# EAGLE design SNAC  7ch SNES in Housing - Minimal with JST (EAGLE 9.0.1)
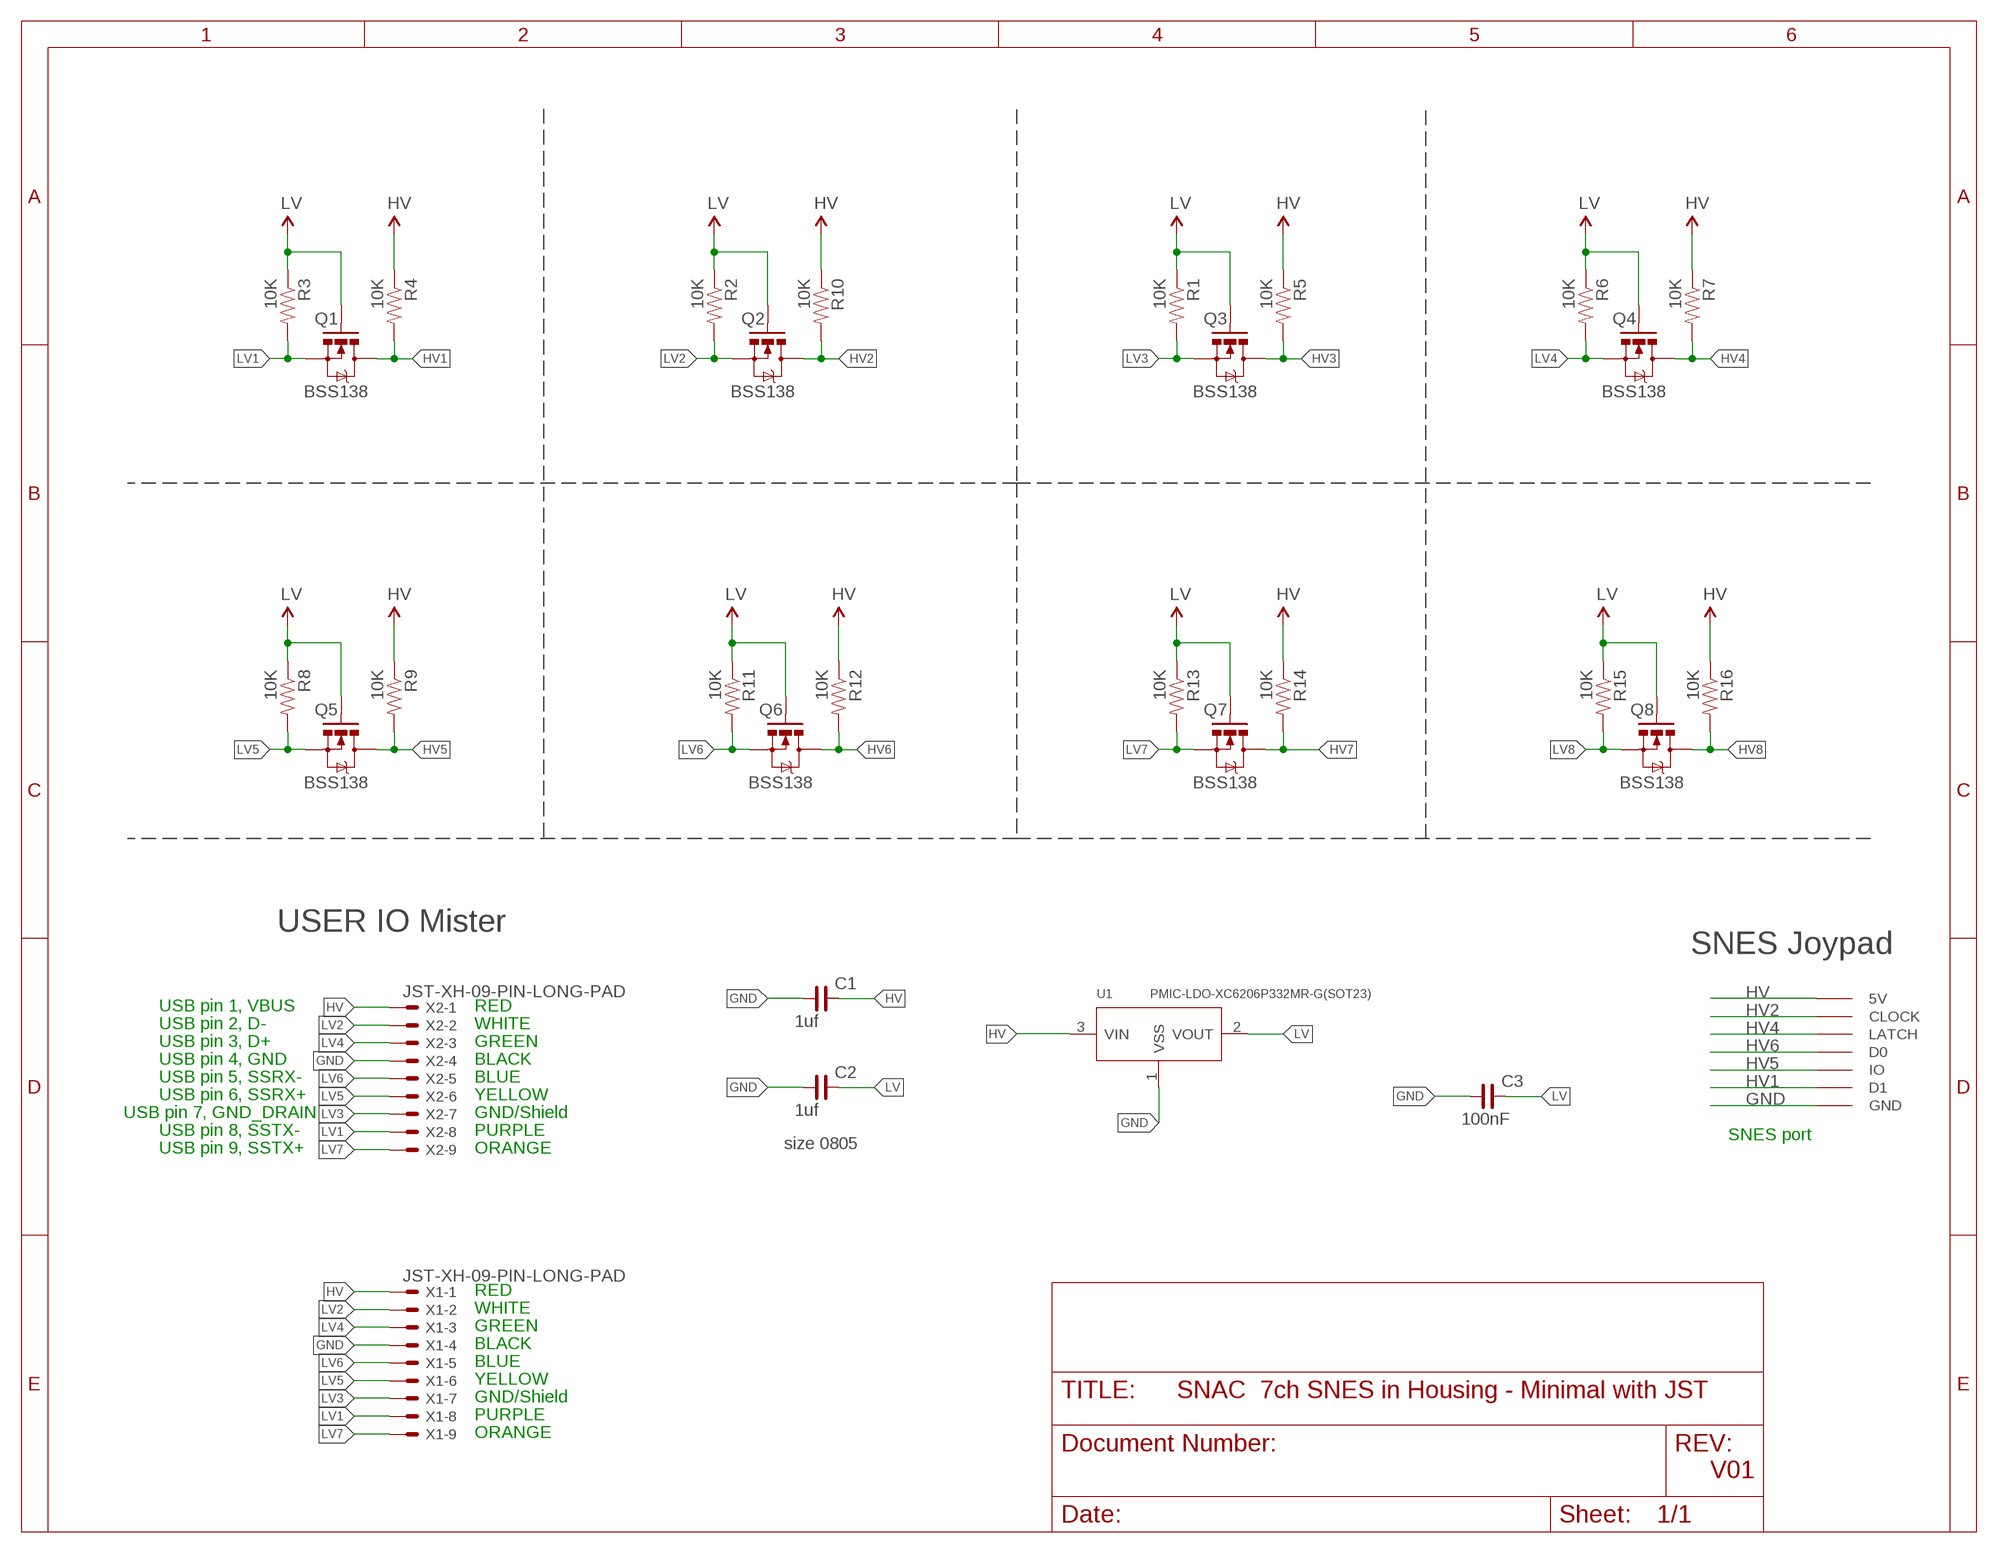
[diagram p0: schematic, sheet 1]

## Parts
C1  1uf  C_0805  [C0805]
C2  1uf  C_0805  [C0805]
C3  100nF  C_0805  [C0805]
Q1  BSS138  MOSFET-NCHANNELSMD  [SOT23-3]
Q2  BSS138  MOSFET-NCHANNELSMD  [SOT23-3]
Q3  BSS138  MOSFET-NCHANNELSMD  [SOT23-3]
Q4  BSS138  MOSFET-NCHANNELSMD  [SOT23-3]
Q5  BSS138  MOSFET-NCHANNELSMD  [SOT23-3]
Q6  BSS138  MOSFET-NCHANNELSMD  [SOT23-3]
Q7  BSS138  MOSFET-NCHANNELSMD  [SOT23-3]
Q8  BSS138  MOSFET-NCHANNELSMD  [SOT23-3]
R1  10K  RESISTOR0603-RES  [0603-RES]
R2  10K  RESISTOR0603-RES  [0603-RES]
R3  10K  RESISTOR0603-RES  [0603-RES]
R4  10K  RESISTOR0603-RES  [0603-RES]
R5  10K  RESISTOR0603-RES  [0603-RES]
R6  10K  RESISTOR0603-RES  [0603-RES]
R7  10K  RESISTOR0603-RES  [0603-RES]
R8  10K  RESISTOR0603-RES  [0603-RES]
R9  10K  RESISTOR0603-RES  [0603-RES]
R10  10K  RESISTOR0603-RES  [0603-RES]
R11  10K  RESISTOR0603-RES  [0603-RES]
R12  10K  RESISTOR0603-RES  [0603-RES]
R13  10K  RESISTOR0603-RES  [0603-RES]
R14  10K  RESISTOR0603-RES  [0603-RES]
R15  10K  RESISTOR0603-RES  [0603-RES]
R16  10K  RESISTOR0603-RES  [0603-RES]
SNES_CON  SNESCONN  [SNESCONN]
U1  PMIC-LDO-XC6206P332MR-G(SOT23)  [SOT-23]
X1  JST-XH-09-PIN-LONG-PAD  [JST-XH-09-PACKAGE-LONG-PAD]
X2  JST-XH-09-PIN-LONG-PAD  [JST-XH-09-PACKAGE-LONG-PAD]

## Nets
GND: C1.1 C2.1 C3.1 SNES_CON.GND U1.1(VSS) X1.4 X2.4
HV: C1.2 R4.1 R5.1 R7.1 R9.1 R10.1 R12.1 R14.1 R16.1 SNES_CON.5V U1.3(VIN) X1.1 X2.1
HV1: Q1.3(D) R4.2 SNES_CON.D1
HV2: Q2.3(D) R10.2 SNES_CON.CLOCK
HV3: Q3.3(D) R5.2
HV4: Q4.3(D) R7.2 SNES_CON.LATCH
HV5: Q5.3(D) R9.2 SNES_CON.IO
HV6: Q6.3(D) R12.2 SNES_CON.D0
HV7: Q7.3(D) R14.2
HV8: Q8.3(D) R16.2
LV: C2.2 C3.2 Q1.1(G) Q2.1(G) Q3.1(G) Q4.1(G) Q5.1(G) Q6.1(G) Q7.1(G) Q8.1(G) R1.1 R2.1 R3.1 R6.1 R8.1 R11.1 R13.1 R15.1 U1.2(VOUT)
LV1: Q1.2(S) R3.2 X1.8 X2.8
LV2: Q2.2(S) R2.2 X1.2 X2.2
LV3: Q3.2(S) R1.2 X1.7 X2.7
LV4: Q4.2(S) R6.2 X1.3 X2.3
LV5: Q5.2(S) R8.2 X1.6 X2.6
LV6: Q6.2(S) R11.2 X1.5 X2.5
LV7: Q7.2(S) R13.2 X1.9 X2.9
LV8: Q8.2(S) R15.2

## Notes on the sheet
- USER IO Mister
- SNES Joypad
- USB pin 1, VBUS | RED
- USB pin 2, D- | WHITE
- USB pin 3, D+ | GREEN
- USB pin 4, GND | BLACK
- USB pin 5, SSRX- | BLUE
- USB pin 6, SSRX+ | YELLOW
- USB pin 7, GND_DRAIN | GND/Shield
- USB pin 8, SSTX- | PURPLE | SNES port
- USB pin 9, SSTX+ | ORANGE | size 0805
- RED
- WHITE
- GREEN
- BLACK
- BLUE
- YELLOW
- GND/Shield
- PURPLE
- ORANGE
- V01

## Library data of the parts
C1-C3 = rc-master-smd:C_: NON-POLARIZED CAP
Q1-Q8 = SparkFun:MOSFET-NCHANNEL
R1-R16 = SparkFun:RESISTOR: Resistor Basic schematic elements and footprints for 0603, 1206, and PTH resistors.
SNES_CON = gamepad-conn:SNESCONN
U1 = PMIC-LDO-XC6206P332MR-G_SOT23_:PMIC-LDO-XC6206P332MR-G(SOT23): 310030099; AVAILABILITY: Unavailable; DESCRIPTION: SMD PMIC; LDO; Vin 6V; 3.3V; 200mA; Without En; 1-Ch; MF: Torex; MP: XC6206P332MR-G; PACKAGE: SOT-23-3 Torex; PRICE: None
X1 X2 = Rembrandt Electronics - JST XH Connectors v1-0:JST-XH-09-PIN: JST XH Connector 2 Pin Wire to board connector. Pitch: 2,54 mm, (0.100") Number of pins: 9 Created by Rembrandt Electronics www.rembrandtelectronics.com

## Board
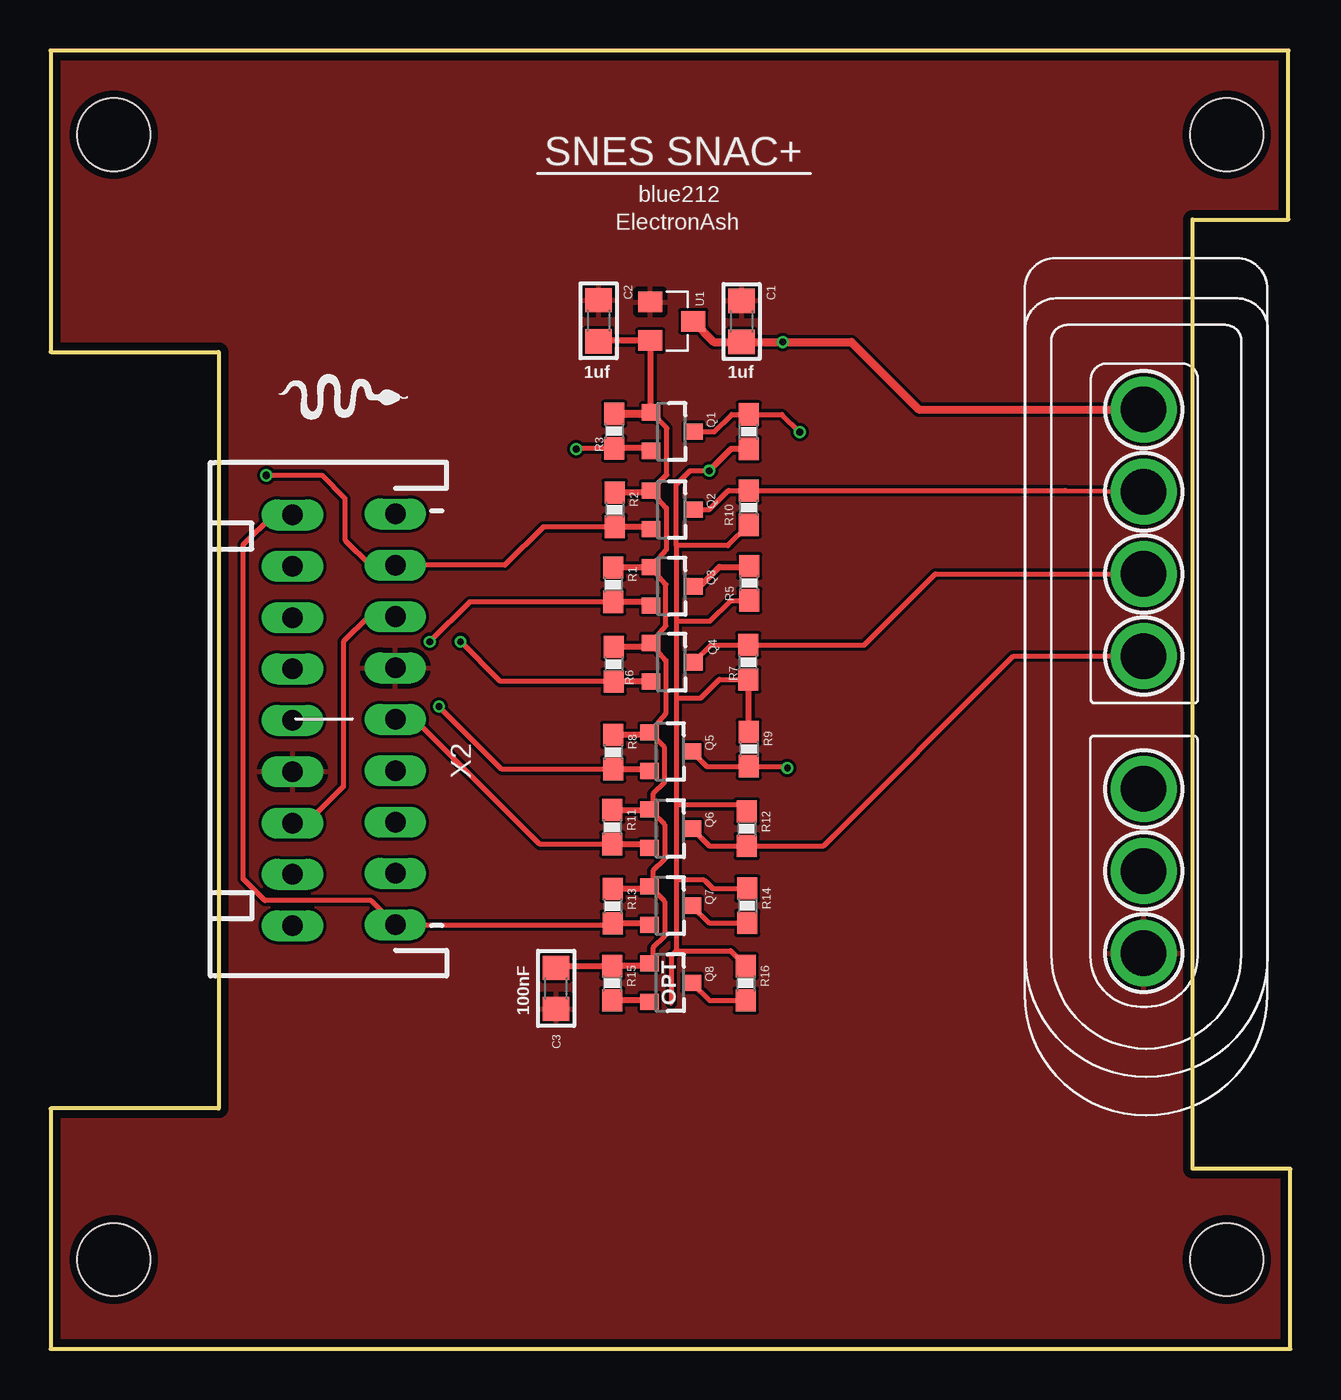
[diagram p1: board, top side]
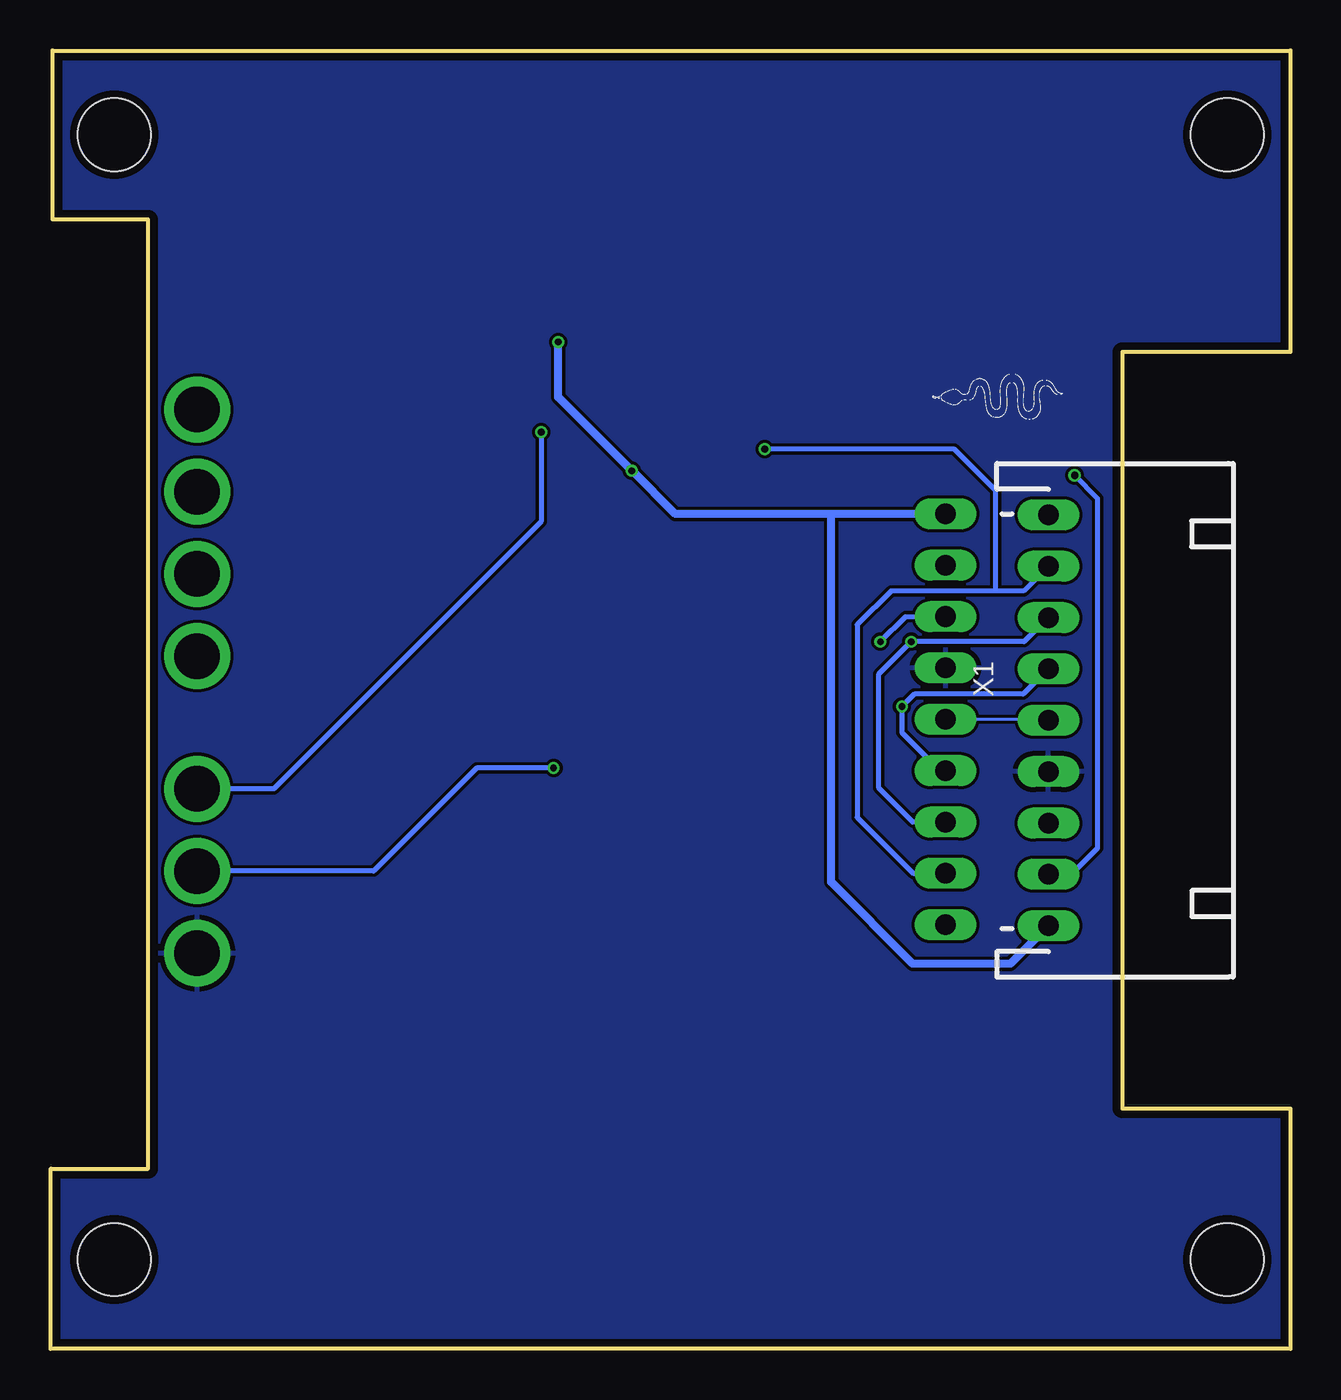
[diagram p2: board, bottom side, seen from below]

Size 61.29 x 64.21 mm. Coordinates in mm from the lower left corner, seen from the top.
Outline: 0,64.21 0,49.3 8.31,49.3 8.31,11.89 0,11.89 0,0 61.29,0 61.29,8.89 61.26,8.92 56.46,8.92 56.46,55.85 61.19,55.85 61.19,64.21 0,64.21
Copper layers (1*16): Top 0.035559375mm / dielectric 1.6mm / Bottom 0.035559375mm
Design rules "oshpark-2layer": minimum track width 6mil, minimum drill 10mil, track to track 6mil, track to pad 6mil, pad to pad 6mil, via to via 6mil, smd to smd 6mil, copper to edge 15mil, drill to drill 6mil, minimum pad ring 5mil, minimum via ring 5mil, stop-mask expansion 2.5mil, vias tented up to drill 0mil, thermal gap 10mil
Holes 3.6 mm at 3.12,60.05 58.14,60.05 3.12,4.42 58.14,4.42

### Footprints (pad centres in the part's own frame; a part is rotated, then mirrored left to right if it is on the bottom)
C0805 = smd 1.2 x 1.3: 1 -1.016,0; 2 1.016,0
SOT23-3 = smd 0.8 x 0.9: 1 -0.95,-1; 2 0.95,-1; 3 0,1.1
0603-RES = smd 1.1 x 1: 1 -0.85,0; 2 0.85,0
SNESCONN = drill 2.25 pad 3.25: 5V 0,4.064; CLOCK 4.064,4.064; D0 12.192,4.064; D1 18.756,4.064; GND 26.884,4.064; IO 22.82,4.064; LATCH 8.128,4.064
SOT-23 = smd 1.016 x 1.2: 1 -0.95,-1.06; 2 0.95,-1.06; 3 0,1.06
JST-XH-09-PACKAGE-LONG-PAD = drill 1.016 long: 1 10.16,0; 2 7.62,0; 3 5.08,0; 4 2.54,0; 5 0,0; 6 -2.54,0; 7 -5.08,0; 8 -7.62,0; 9 -10.16,0

### Placement (x,y rotation side)
C1  34.16,50.82 270 top
C2  27.09,50.85 270 top
C3  24.99,17.83 90 top
Q1  30.68,45.36 270 top
Q2  30.68,41.5 270 top
Q3  30.68,37.72 270 top
Q4  30.68,33.96 270 top
Q5  30.61,29.54 270 top
Q6  30.61,25.73 270 top
Q7  30.61,21.92 270 top
Q8  30.61,18.11 270 top
R1  27.81,37.8 270 top
R2  27.89,41.5 270 top
R3  27.86,45.39 270 top
R4  34.51,45.37 90 top
R5  34.54,37.87 90 top
R6  27.84,33.86 270 top
R7  34.49,33.96 90 top
R8  27.81,29.51 270 top
R9  34.52,29.67 270 top
R10  34.52,41.61 90 top
R11  27.76,25.81 270 top
R12  34.42,25.73 270 top
R13  27.79,21.89 270 top
R14  34.44,21.92 270 top
R15  27.76,18.08 270 top
R16  34.37,18.08 270 top
SNES_CON  49.98,46.46 270 top
U1  30.71,50.83 270 top
X1  11.96,31.09 270 bottom
X2  17.04,31.14 90 top

### Tracks (layer width: path | path; a pad name or v marks a point on that pad's centre or on a via)
GND
  pour Top: 61.14,64.16 61.19,64.16 61.19,55.85 56.46,55.85 56.46,8.92 61.26,8.92 61.26,0.03 -0.05,0.05 0,11.89 8.31,11.89 8.31,49.28 0,49.28 0,64.21
  pour Bottom: 61.19,64.16 61.19,55.85 56.46,55.85 56.46,8.92 61.26,8.92 61.26,-0.03 -0.05,0.05 0,11.89 8.31,11.89 8.31,49.3 0,49.3 0,64.24
HV  (via drill 0.33)
  Top 0.178: 30.98,26.58 30.94,26.62
  Top 0.254: 30.94,39.73 30.94,35.99 | 30.94,35.99 30.94,32.18 | 30.94,32.18 30.94,26.9 | 30.94,26.9 30.94,26.62 30.94,23.19 | 30.94,23.19 30.94,19.68 | 30.94,23.19 32.31,23.19 32.73,22.77 R14.1 | 30.94,19.68 30.68,19.43 30.68,17.09 | 30.94,35.99 32.59,35.99 33.62,37.02 R5.1 | 30.94,32.18 32.13,32.18 33.06,33.11 R7.1 | 30.94,19.68 33.62,19.68 R16.1 | R10.1 33.49,39.73 30.94,39.73 | 30.94,39.73 30.94,42.75 31.62,43.43 v32.56,43.43 | R12.1 34.1,26.9 30.94,26.9
  Top 0.305: v32.56,43.43 33.65,44.52 R4.1 | R9.1 34.52,33.08 R7.1
  Top 0.406: 31.62,50.68 U1.3 32.79,49.8 C1.2 v36.19,49.8 39.58,49.8 42.93,46.46 SNES_CON.5V
  Bottom 0.406: X2.1 22.71,41.3 | X1.1 13.84,19.05 18.67,19.05 22.71,23.09 22.71,41.3 | 22.71,41.3 30.4,41.3 32.54,43.43 v32.56,43.43 36.19,47.07 v36.19,49.8
HV1  (via drill 0.33)
  Top 0.178: 34.6,46.3 R4.2
  Top 0.254: Q1.3 32.82,45.36 33.67,46.22 R4.2 36.15,46.22 v37.03,45.34
  Bottom 0.254: v37.03,45.34 37.03,40.92 50.25,27.7 SNES_CON.D1
HV2
  Top 0.178: 34.51,42.44 R10.2
  Top 0.254: Q2.3 32.56,41.5 33.51,42.45 R10.2 50.18,42.45 SNES_CON.CLOCK
HV3
  Top 0.178: Q3.3 32.11,37.72 | R5.2 34.59,38.68
  Top 0.305: 32.11,37.72 33.06,38.68 34.59,38.68
HV4
  Top 0.254: Q4.3 32.63,34.81 R7.2 40.22,34.81 43.74,38.33 SNES_CON.LATCH
HV5  (via drill 0.33)
  Top 0.254: Q5.3 32.43,28.82 R9.2 36.33,28.82 v36.42,28.73
  Bottom 0.254: v36.42,28.73 40.23,28.73 45.32,23.64 SNES_CON.IO
HV6
  Top 0.178: R12.2 34.5,24.97
  Top 0.254: Q6.3 32.56,24.88 R12.2 38.21,24.88 47.6,34.26 SNES_CON.D0
HV7
  Top 0.178: 34.53,21.16 R14.2
  Top 0.254: Q7.3 32.56,21.07 R14.2
HV8
  Top 0.254: Q8.3 32.58,17.23 R16.2
LV
  Top 0.178: 29.78,34.81 Q4.1 | 29.68,42.52 Q2.1 29.56,42.33 29.53,42.35 | Q4.1 | 29.78,26.49 29.78,26.51 Q6.1 | Q8.1 | 29.78,19.23 Q8.1 | 29.78,23.04 Q7.1 | 29.51,26.58 Q6.1 | 29.78,26.85 Q6.1 | Q4.1 29.59,35 29.3,34.71 | 29.67,30.43 Q5.1 29.48,30.36 | Q3.1 29.58,38.57 29.51,38.64 | 30.47,43.23 30.46,43.23 | 29.62,19.05 Q8.1 | Q1.1 29.61,46.24 | 28.32,30.36 R8.1 | 29.58,26.66 Q6.1
  Top 0.254: 30.47,43.23 30.47,45.53 Q1.1 | 29.78,19.23 29.78,19.82 30.35,20.4 30.35,22.12 Q7.1 | 29.78,23.04 29.78,23.63 30.35,24.21 30.35,25.93 29.78,26.51 | 29.78,26.85 29.78,27.44 30.35,28.02 30.35,29.74 Q5.1 30.42,31.43 30.42,34.05 Q4.1 30.42,35.77 30.42,37.81 Q3.1 30.44,39.53 30.44,41.59 Q2.1 30.46,43.23
  Top 0.305: U1.2 29.57,49.88 | 29.57,49.88 27.13,49.88 C2.2 26.82,49.83 | 29.53,42.35 R2.1 | 29.51,38.64 R1.1 | 29.3,34.71 R6.1 | 29.48,30.36 28.32,30.36 | R11.1 29.58,26.66 | 29.6,18.93 R15.1 25.08,18.93 C3.2 | 29.61,22.74 R13.1 | Q1.1 29.68,49.76 29.57,49.88
  Top 0.406: 29.61,46.24 R3.1 | Q8.1 29.6,18.93 | Q7.1 29.61,22.74
LV1  (via drill 0.33)
  Top 0.178: Q1.2 29.56,44.54
  Top 0.254: v25.98,44.5 26.02,44.54 R3.2
  Top 0.305: 29.56,44.54 R3.2
  Bottom 0.254: X1.8 13.18,37.49 14.55,37.49 | X2.8 18.64,23.52 21.41,26.29 21.41,35.81 19.74,37.49 14.55,37.49 | 14.55,37.49 14.55,42.44 16.61,44.5 v25.98,44.5
LV2  (via drill 0.35)
  Top 0.178: Q2.2 29.58,40.65
  Top 0.254: R2.2 24.35,40.65 22.45,38.76 X2.2 15.8,38.76 14.55,40 14.55,42.06 13.41,43.21 v10.67,43.21
  Top 0.305: 29.58,40.65 R2.2
  Bottom 0.254: X1.2 10.82,23.47 9.52,24.76 9.52,42.06 v10.67,43.21
LV3  (via drill 0.33)
  Top 0.178: Q3.2 29.51,36.94
  Top 0.254: R1.2 20.71,36.94 v18.74,34.98
  Top 0.305: 29.51,36.94 R1.2
  Bottom 0.254: X1.7 13.16,34.98 v18.74,34.98 20.35,33.38 20.35,27.74 18.67,26.06 X2.7
LV4  (via drill 0.33)
  Top 0.178: Q4.2 29.66,33.03 29.63,33.01 | R6.2 27.77,33.01
  Top 0.254: X1.3 12.67,26.01 14.48,27.81 14.48,34.98 15.72,36.22 X2.3 16.56,36.22 | R6.2 22.24,33.01 v20.27,34.98
  Top 0.305: 29.63,33.01 R6.2
  Bottom 0.254: v20.27,34.98 19.02,36.22 X2.3
LV5  (via drill 0.33)
  Top 0.178: Q5.2 29.53,28.66
  Top 0.254: R8.2 22.31,28.66 v19.2,31.78
  Top 0.305: 29.53,28.66 R8.2
  Bottom 0.254: X2.6 17.32,28.6 19.2,30.48 v19.2,31.78 18.59,32.38 13.21,32.38 X1.6
LV6
  Top 0.152: 18.01,31.14 X2.5
  Top 0.178: Q6.2 29.42,24.97 29.41,24.96
  Top 0.254: R11.2 24.19,24.96 18.01,31.14
  Top 0.305: 29.41,24.96 R11.2
  Bottom 0.152: X1.5 12.01,31.14 X2.5
LV7
  Top 0.152: 27.72,20.98 R13.2
  Top 0.178: Q7.2 29.53,21.04
  Top 0.254: 27.72,20.98 X2.9 15.85,22.17 10.59,22.17 9.52,23.24 9.52,39.78 11,41.25 X1.9
  Top 0.305: 29.53,21.04 R13.2
LV8
  Top 0.178: 29.42,17.35 Q8.2
  Top 0.305: 29.42,17.23 R15.2 27.72,17.23
  Top 0.406: 29.42,17.35 29.42,17.23

### Text on the board
tPlace: SNES SNAC+ | blue212 | ElectronAsh | 1uf | 1uf | 100nF | OPT